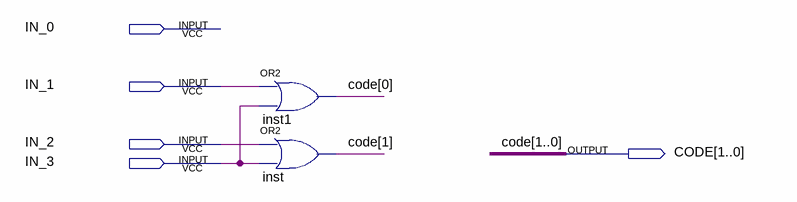
[diagram p0: schematic sheet]
// Quartus schematic decoder4to2.bdf as structural Verilog: 2 symbols, 5 pins
module decoder4to2 (
  input  IN_0,
  input  IN_1,
  input  IN_2,
  input  IN_3,
  output [1:0] CODE
);

  or inst1 (CODE[0], IN_1, IN_3);
  or inst (CODE[1], IN_2, IN_3);
endmodule
